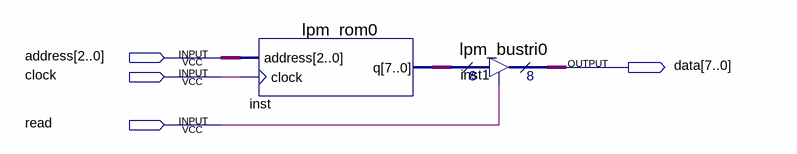
[diagram p0: schematic sheet]
// Quartus schematic ROM.bdf as structural Verilog: 2 symbols, 4 pins
module ROM (
  input  [2:0] address,
  input  clock,
  input  read,
  output [7:0] data
);

  wire [7:0] inst_q;

  lpm_rom0 inst (.address(address), .clock(clock), .q(inst_q));
  lpm_bustri0 inst1 (.enabledt(read), .data(inst_q), .tridata(data));
endmodule
